# EAGLE design Drone Basic (EAGLE 9.6.2)
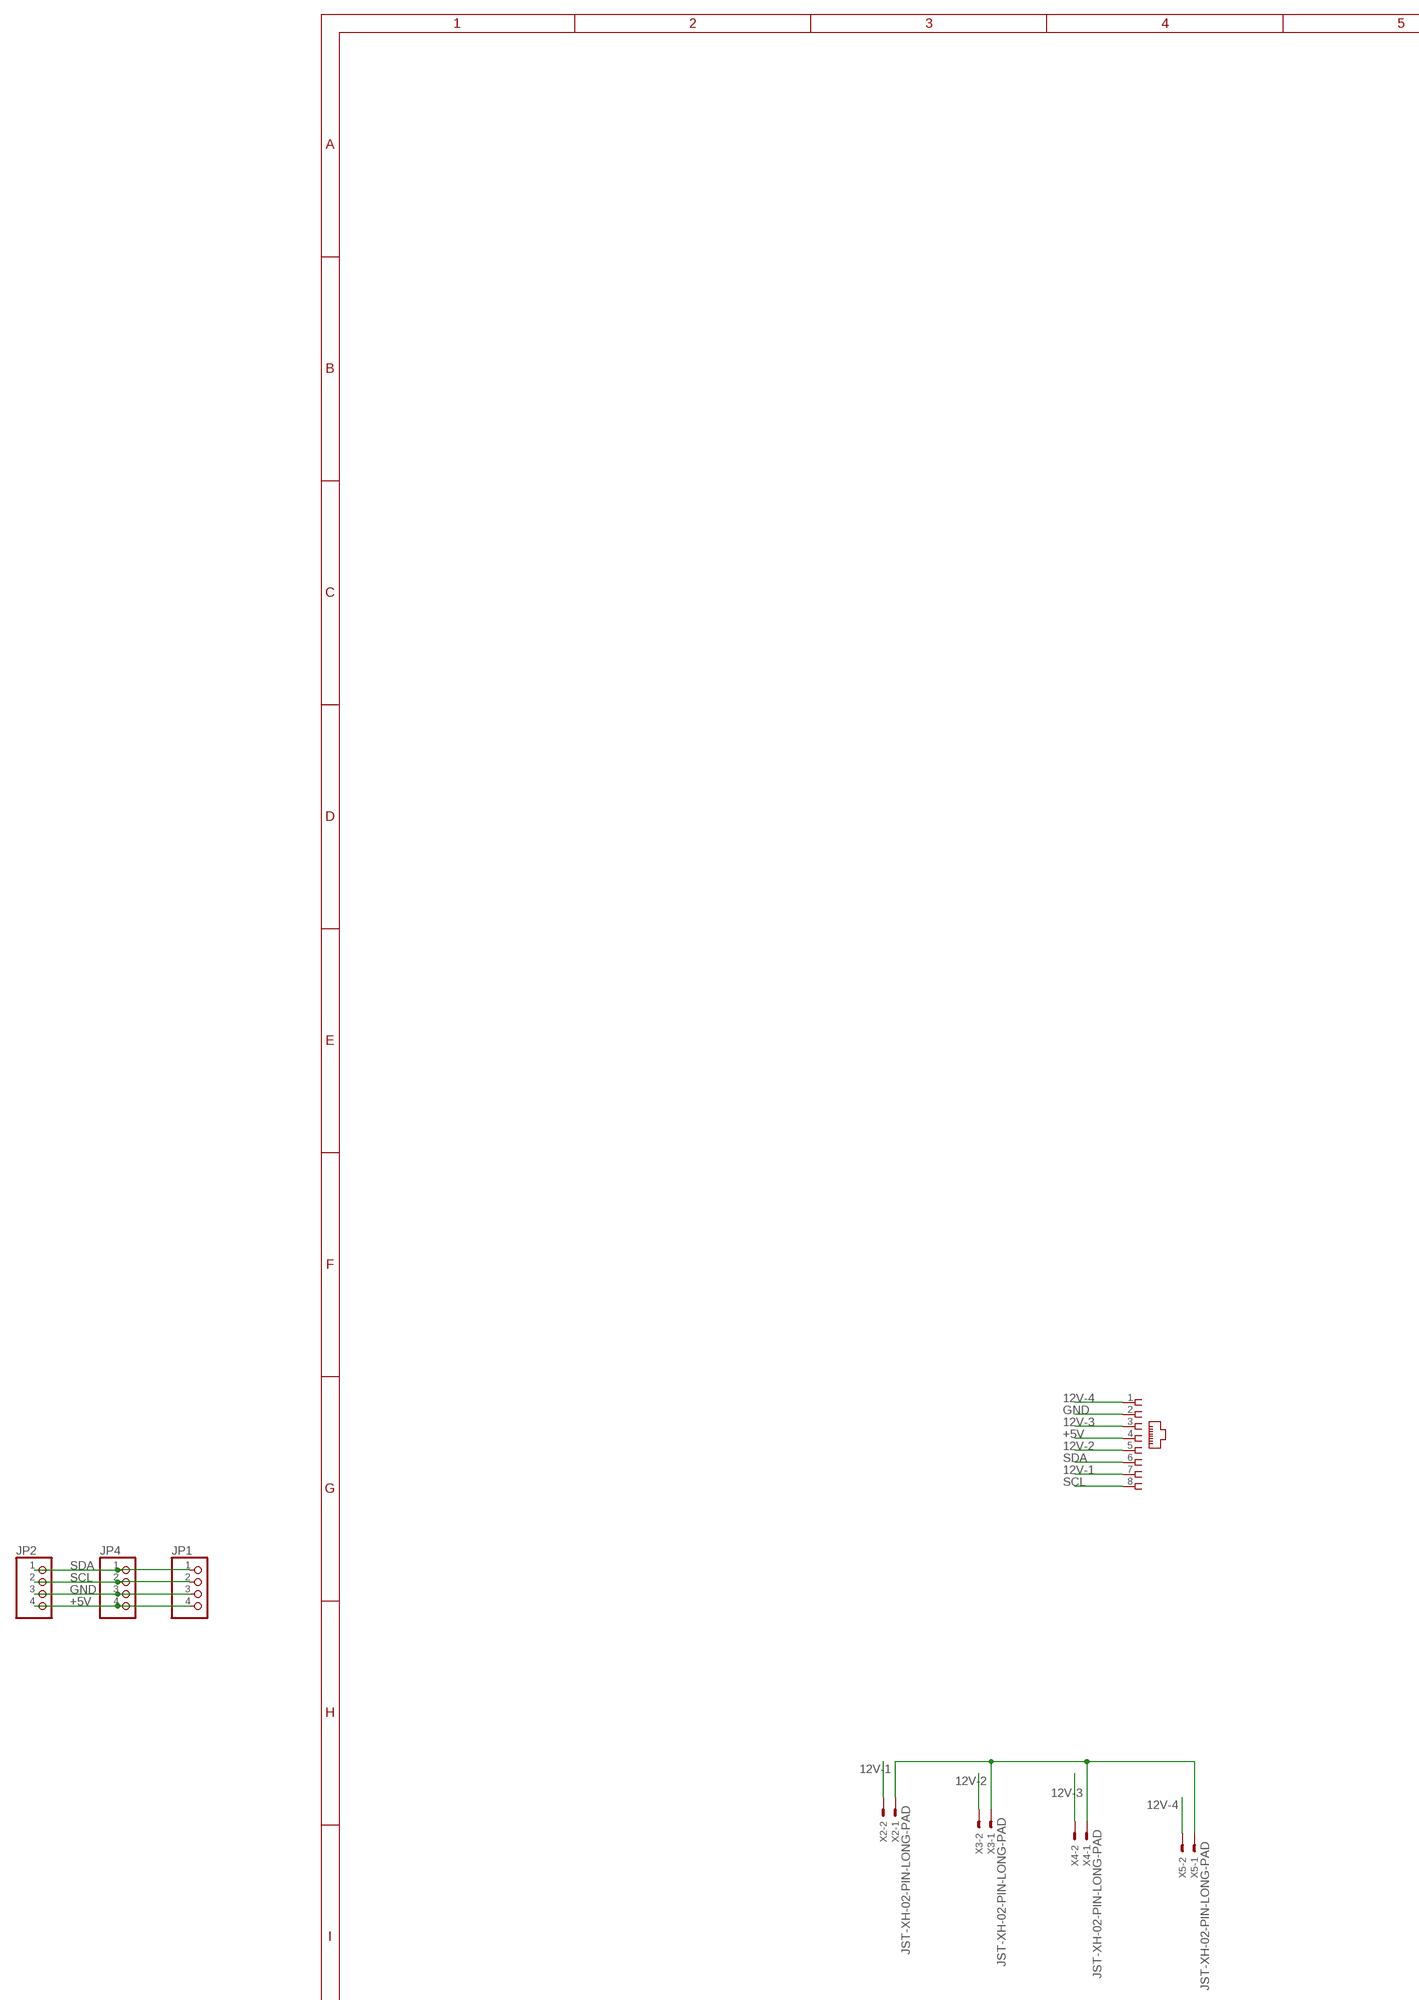
[diagram p0: schematic, sheet 1, part 1 of 2]
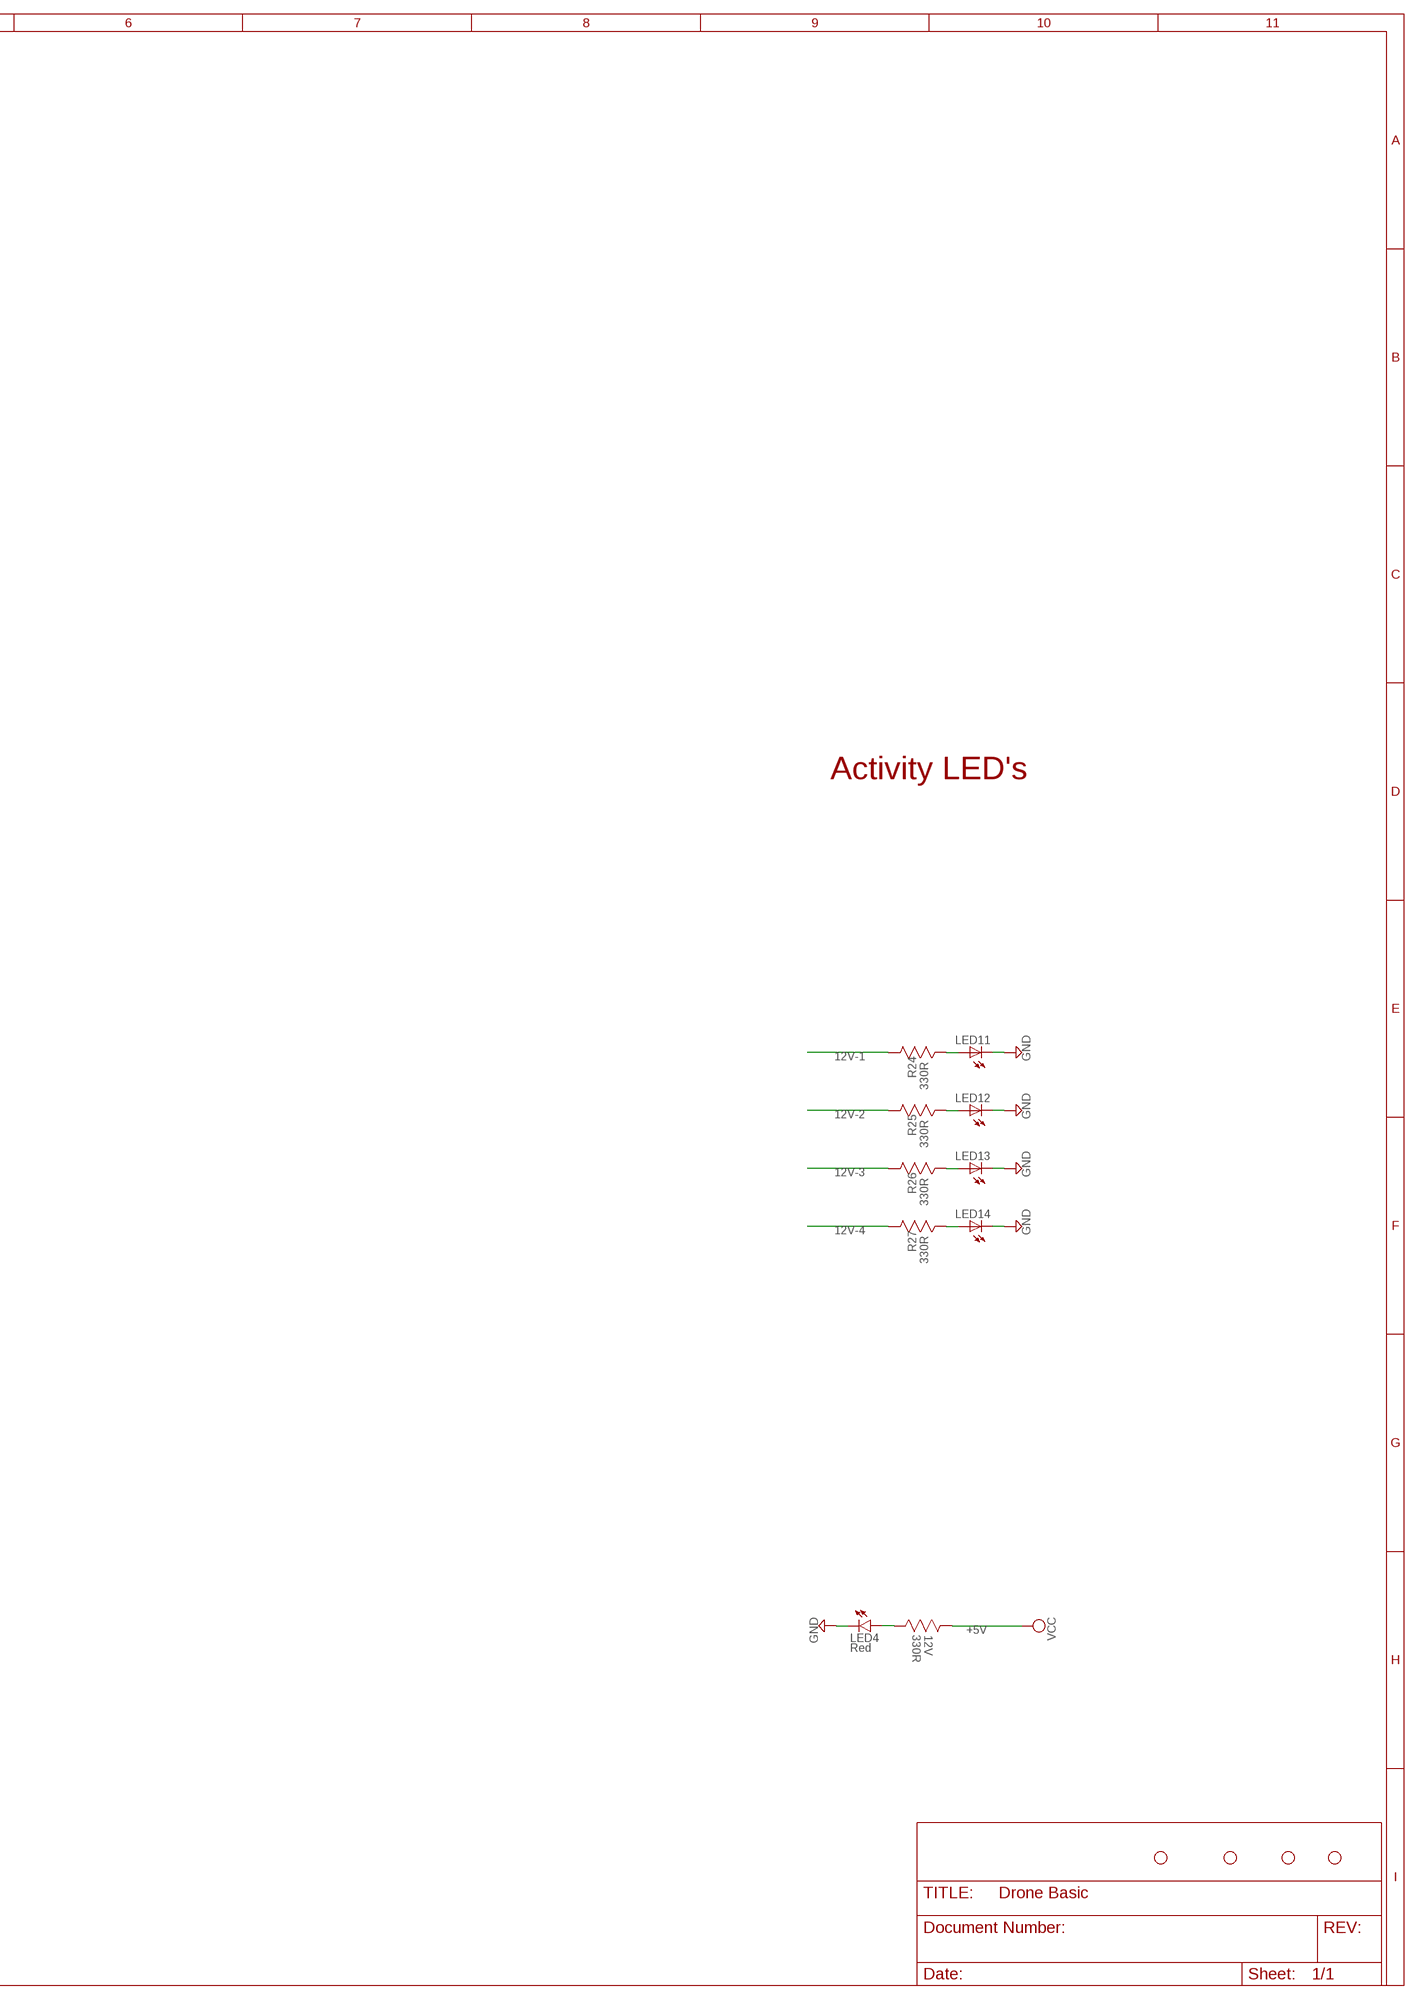
[diagram p1: schematic, sheet 1, part 2 of 2]

## Parts
12V  330R  MC0.063W06031%330R  [RESC1608X60N]
H5  STAND-OFF  [STAND-OFF]
H6  STAND-OFF  [STAND-OFF]
H7  STAND-OFF  [STAND-OFF]
H8  STAND-OFF  [STAND-OFF]
JP1  PINHD-1X4  [1X04]
JP2  PINHD-1X4  [1X04]
JP4  PINHD-1X4  [1X04]
LED4  Red  LED-RED-0603-WE  [LED-0603]
LED11  BLUE  LEDCHIPLED_0805  [CHIPLED_0805]
LED12  GREEN  LEDCHIPLED_0805  [CHIPLED_0805]
LED13  Yellow  LEDCHIPLED_0805  [CHIPLED_0805]
LED14  RED  LEDCHIPLED_0805  [CHIPLED_0805]
PUMPBOX-2  RJ45-6L-B  [RJ45-NO-SHIELD]
R24  330R  MC0.063W06031%330R  [RESC1608X60N]
R25  330R  MC0.063W06031%330R  [RESC1608X60N]
R26  330R  MC0.063W06031%330R  [RESC1608X60N]
R27  330R  MC0.063W06031%330R  [RESC1608X60N]
X2  JST-XH-02-PIN-LONG-PAD  [JST-XH-02-PACKAGE-LONG-PAD]
X3  JST-XH-02-PIN-LONG-PAD  [JST-XH-02-PACKAGE-LONG-PAD]
X4  JST-XH-02-PIN-LONG-PAD  [JST-XH-02-PACKAGE-LONG-PAD]
X5  JST-XH-02-PIN-LONG-PAD  [JST-XH-02-PACKAGE-LONG-PAD]

## Nets
12V-1: PUMPBOX-2.7 R24.1(R1) X2.2
12V-2: PUMPBOX-2.5 R25.1(R1) X3.2
12V-3: PUMPBOX-2.3 R26.1(R1) X4.2
12V-4: PUMPBOX-2.1 R27.1(R1) X5.2
+5V [5v]: 12V.1(R1) JP1.4 JP2.4 JP4.4 PUMPBOX-2.4 ; supply symbol labelled VCC
GND: JP1.3 JP2.3 JP4.3 LED4.C LED11.C LED12.C LED13.C LED14.C PUMPBOX-2.2 X2.1 X3.1 X4.1 X5.1
N$47: 12V.2(R2) LED4.A
N$54 [GPIO]: LED11.A R24.2(R2)
N$55 [GPIO]: LED12.A R25.2(R2)
N$56 [GPIO]: LED13.A R26.2(R2)
N$57 [GPIO]: LED14.A R27.2(R2)
SCL: JP1.2 JP2.2 JP4.2 PUMPBOX-2.8
SDA: JP1.1 JP2.1 JP4.1 PUMPBOX-2.6

## Notes on the sheet
- Activity LED's

## Library data of the parts
12V R24-R27 = Multicomp:MC0.063W06031%330R: RESISTOR, 0603; MPN: MC0.063W06031%330R; OC_FARNELL: 9331018; OC_NEWARK: -; SUPPLIER: Multicomp; TOLERANCE: ±1%; VALUE: 330 Ohms; WATTAGE: 1/16 W
H5-H8 = SparkFun-Hardware:STAND-OFF: Stand Off Drill holes for mechanically mounting via screws, standoffs, etc. Note: Use the keepout ring to avoid running the screw head into surrounding components. Variant Overviews STAND-OFF - Mechanical footprint for a #4 phillips button head screw. STAND-OFF-TIGHT - Mechanical footprint for a #4 phillips button head screw, Example SparkFun Products Screw - Phillips Head (1/4", 4-40, 10 pack) <https://www.sparkfun.com/products/10453> (PRT-10453) Screw - Phillips Head (1/2", 4-40, 10 pack) <https://www.sparkfun.com/products/10452> (PRT-10452) Screw - Phillips Head (3/4", 4-40, 10 pack) <https://www.sparkfun.com/products/10451> (PRT-10451) Screw - Phillips Head (1", 4-40, 10 pack) <https://www.sparkfun.com/products/10450> (PRT-10450)
JP1 JP2 JP4 = pinhead:PINHD-1X4: PIN HEADER
LED4 = SparkFun-LED:LED-RED: Red SMD LED Used in manufacturing of most products at SparkFun Packages: 0603 - SMD 0603 package [Product Link] <http://docs.avagotech.com/docs/AV02-0551EN> 0603 SMART - SMD 0603 SMART package ( more efficient and expensive)[Product Link] <http://www.osram-os.com/Graphics/XPic2/00077099_0.pdf> 1206 - SMD1206 package [Product Link] <https://www.sparkfun.com/datasheets/DevTools/LilyPad/Q150OVS4.pdff> SparkFun Products: Pro Mini 328 -5V <https://www.sparkfun.com/products/821> RedBoard <https://www.sparkfun.com/products/12757> IOIO-OTG <https://www.sparkfun.com/products/13613>; PROD_ID: DIO-16511
LED11-LED14 = adafruit:LED: LED OSRAM: - CHIPLED LG R971, LG N971, LY N971, LG Q971, LY Q971, LO R971, LY R971 LH N974, LH R974 LS Q976, LO Q976, LY Q976 LO Q996 - Hyper CHIPLED LW Q18S LB Q993, LB Q99A, LB R99A - SideLED LS A670, LO A670, LY A670, LG A670, LP A670 LB A673, LV A673, LT A673, LW A673 LH A674 LY A675 LS A676, LA A676, LO A676, LY A676, LW A676 LS A679, LY A679, LG A679 - Hyper Micro SIDELED® LS Y876, LA Y876, LO Y876, LY Y876 LT Y87S - SmartLED LW L88C, LW L88S LB L89C, LB L89S, LG L890 LS L89K, LO L89K, LY L89K LS L896, LA L896, LO L896, LY L896 - TOPLED LS T670, LO T670, LY T670, LG T670, LP T670 LSG T670, LSP T670, LSY T670, LOP T670, LYG T670 LG T671, LOG T671, LSG T671 LB T673, LV T673, LT T673, LW T673 LH T674 LS T676, LA T676, LO T676, LY T676, LB T676, LH T676, LSB T676, LW T676 LB T67C, LV T67C, LT T67C, LS T67K, LO T67K, LY T67K, LW E67C LS E67B, LA E67B, LO E67B, LY E67B, LB E67C, LV E67C, LT E67C LW T67C LS T679, LY T679, LG T679 LS T770, LO T770, LY T770, LG T770, LP T770 LB T773, LV T773, LT T773, LW T773 LH T774 LS E675, LA E675, LY E675, LS T675 LS T776, LA T776, LO T776, LY T776, LB T776 LHGB T686 LT T68C, LB T68C - Hyper Mini TOPLED® LB M676 - Mini TOPLED Santana® LG M470 LS M47K, LO M47K, LY M47K Source: http://www.osram.convergy.de/
PUMPBOX-2 = con-tycoelectronics:RJ45: CORCOM Modular RJ Jacks No Shield Source: www.tycoelectronics.com .. ENG_DS_1654001_1099_RJ_L_0507.pdf; MPN: RJ45-6L-B; OC_FARNELL: unknown; OC_NEWARK: 16R6090
X2-X5 = Rembrandt Electronics - JST XH Connectors v1-0:JST-XH-02-PIN: JST XH Connector 2 Pin Wire to board connector. Pitch: 2,54 mm, (0.100") Number of pins: 2 Created by Rembrandt Electronics www.rembrandtelectronics.com

## Net classes
0 default: width 0.356 mm, drill 0.102 mm, clearance 0.254 mm
1 highpower: width 0.356 mm, drill 0.356 mm
2 12v: width 0.457 mm, drill 0.102 mm, clearance 0.254 mm
3 5v: width 0.406 mm, drill 0.102 mm, clearance 0.254 mm
4 3.3v: width 0.406 mm, drill 0.102 mm, clearance 0.254 mm
5 i2c: width 0.356 mm, drill 0.102 mm, clearance 0.254 mm
6 GPIO: width 0.356 mm, drill 0.102 mm, clearance 0.254 mm
8 New Class: drill 0.102 mm, clearance 0.152 mm

## Board
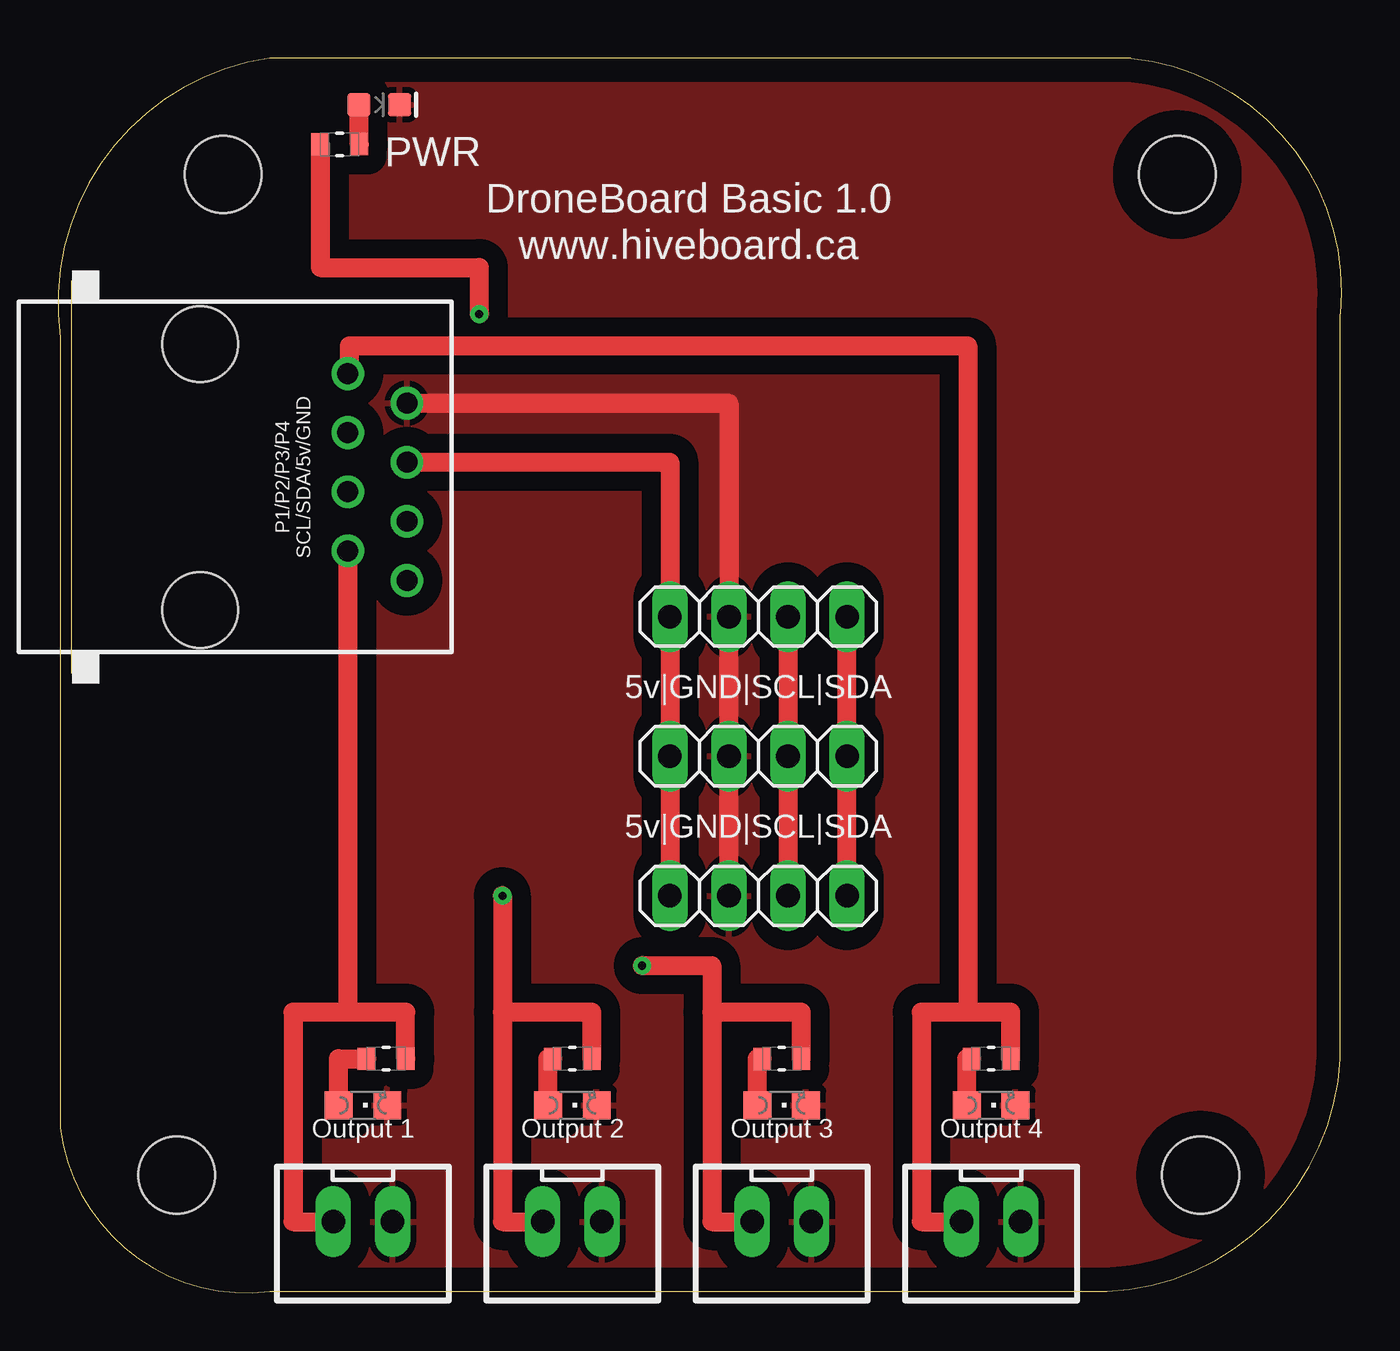
[diagram p2: board, top side]
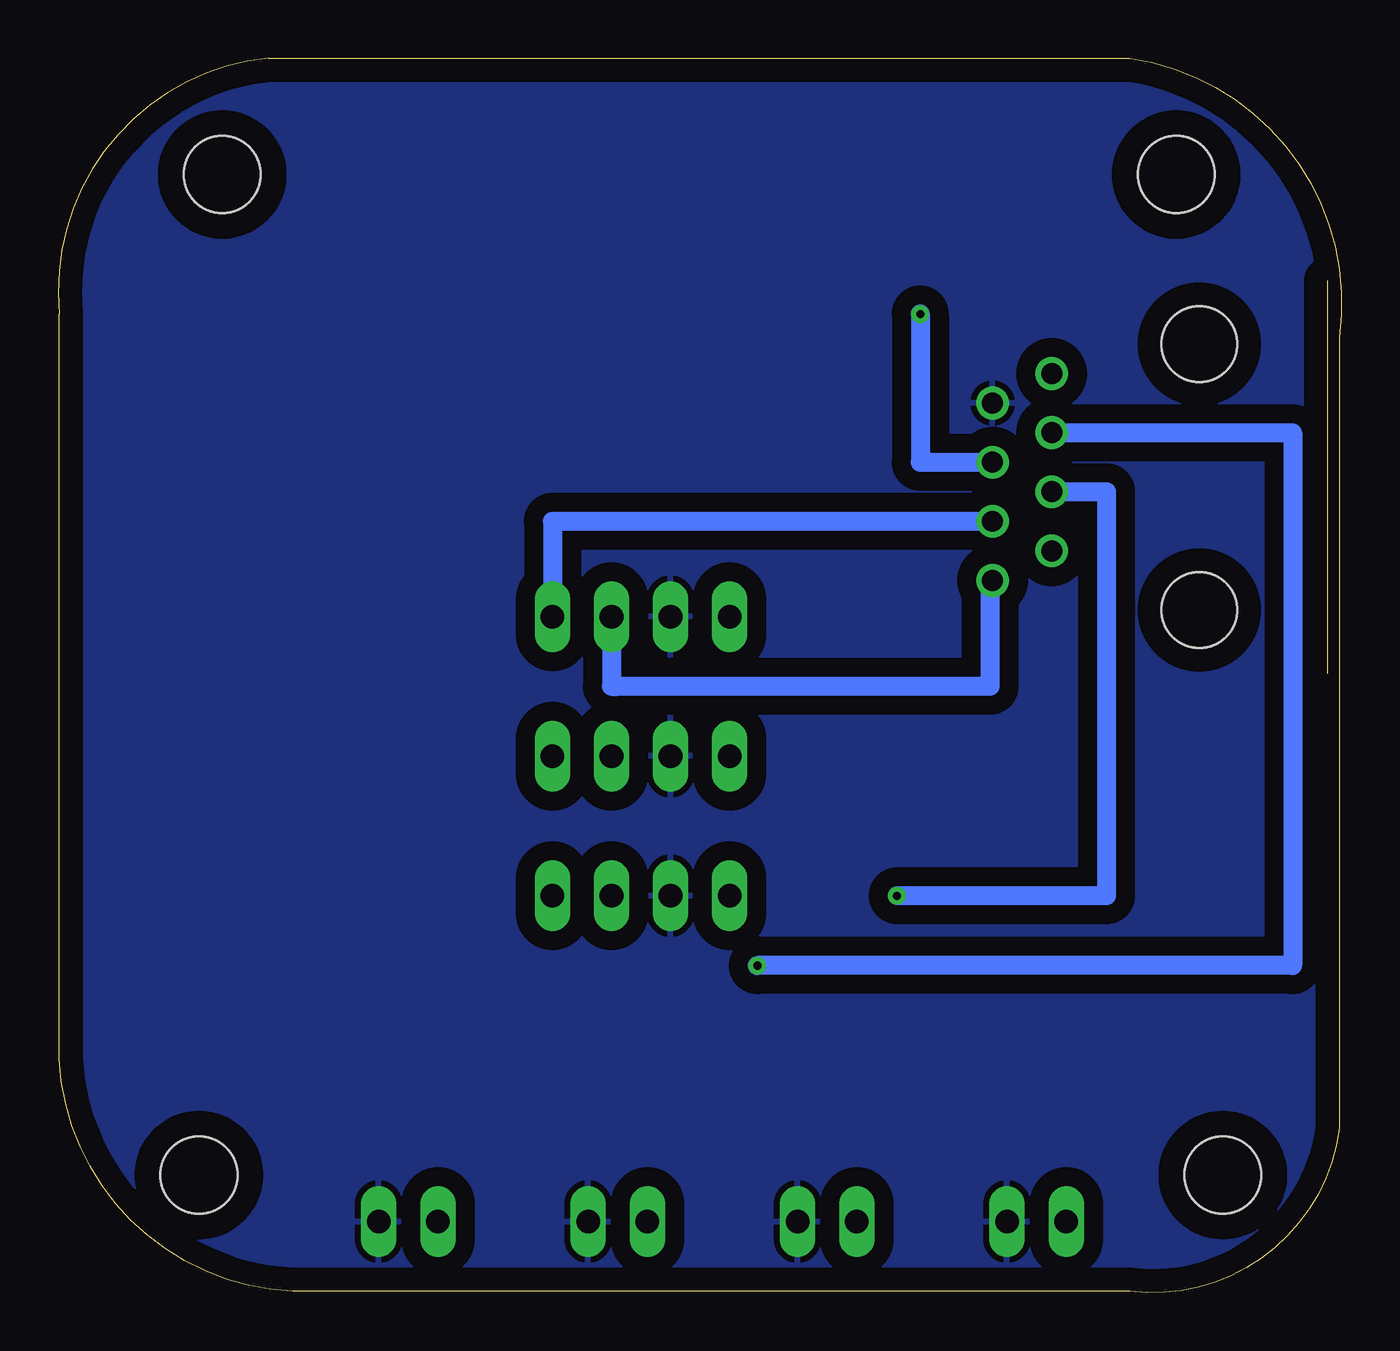
[diagram p3: board, bottom side, seen from below]

Size 55.15 x 53.06 mm. Coordinates in mm from the lower left corner, seen from the top.
Outline: 9.1,0.06 44.1,0.06 arc90 55.1,10.06 55.1,42.06 arc90 46.1,53.06 9.1,53.06 arc90 0.1,41.06 0.1,7.06 arc90 9.1,0.06
Copper layers (1*16): Top 0.035mm / dielectric 1.5mm / Bottom 0.035mm
Design rules "default *": minimum track width 6mil, minimum drill 0.35mm, track to track 6mil, track to pad 6mil, pad to pad 6mil, via to via 6mil, smd to smd 6mil, copper to edge 40mil, drill to drill 6mil, minimum pad ring 10mil, minimum via ring 8mil, stop-mask expansion 4mil, vias tented up to drill 0mil, thermal gap 10mil

### Footprints (pad centres in the part's own frame; a part is rotated, then mirrored left to right if it is on the bottom)
RESC1608X60N = smd 0.762 x 0.94: 1 -0.838,0; 2 0.838,0
STAND-OFF = hole 3.302: 0,0
1X04 = drill 1.016 long: 1 -3.81,0; 2 -1.27,0; 3 1.27,0; 4 3.81,0
LED-0603 = smd 1 x 1: A -0.877,0; C 0.877,0
CHIPLED_0805 = smd 1.2 x 1.2: A 0,-1.05; C 0,1.05
RJ45-NO-SHIELD = drill 0.9 pad 1.4: 1 -4.445,6.35; 2 -3.175,8.89; 3 -1.905,6.35; 4 -0.635,8.89; 5 0.635,6.35; 6 1.905,8.89; 7 3.175,6.35; 8 4.445,8.89 | hole 3.251: -5.715,0; 5.715,0
JST-XH-02-PACKAGE-LONG-PAD = drill 1.016 long: 1 -1.27,0; 2 1.27,0

### Placement (x,y rotation side)
12V  12.1,49.36 0 top
H5  7.1,48.06 0 top
H6  5.1,5.06 0 top
H7  49.1,5.06 0 top
H8  48.1,48.06 0 top
JP1  30.1,17.06 180 top
JP2  30.1,29.06 180 top
JP4  30.1,23.06 180 top
LED4  13.8,51.06 0 top
LED11  13.1,8.06 270 top
LED12  22.1,8.06 270 top
LED13  31.1,8.06 270 top
LED14  40.1,8.06 270 top
PUMPBOX-2  6.1,35.06 270 top
R24  14.1,10.06 180 top
R25  22.1,10.06 180 top
R26  31.1,10.06 180 top
R27  40.1,10.06 180 top
X2  13.1,3.06 180 top
X3  22.1,3.06 180 top
X4  31.1,3.06 180 top
X5  40.1,3.06 180 top

### Tracks (layer width: path | path; a pad name or v marks a point on that pad's centre or on a via)
12V-1
  Top 0.813: R24.1 14.93,12.06 12.45,12.06 | X2.2 10.1,3.06 10.1,12.06 12.1,12.06 12.45,12.06 | PUMPBOX-2.7 12.45,12.06
12V-2  (via drill 0.35)
  Top 0.813: R25.1 22.93,12.06 19.1,12.06 | 19.1,12.06 19.1,3.06 X3.2 | v19.1,17.06 19.1,12.06
  Bottom 0.813: PUMPBOX-2.5 10.1,34.42 10.1,17.06 v19.1,17.06
12V-3  (via drill 0.35)
  Top 0.813: R26.1 31.93,12.06 28.1,12.06 | 28.1,12.06 28.1,3.06 X4.2 | v25.1,14.06 28.1,14.06 28.1,12.06
  Bottom 0.813: PUMPBOX-2.3 2.1,36.96 2.1,14.06 v25.1,14.06
12V-4
  Top 0.813: R27.1 40.93,12.06 39.1,12.06 | 39.1,12.06 37.1,12.06 37.1,3.06 X5.2 | PUMPBOX-2.1 12.52,39.5 12.52,40.7 39.1,40.7 39.1,12.06
+5V  (via drill 0.35)
  Top 0.813: JP1.4 JP4.4 JP2.4 26.29,35.69 PUMPBOX-2.4 | 12V.1 11.26,44.06 18.1,44.06 v18.1,42.06
  Bottom 0.813: v18.1,42.06 18.1,35.69 PUMPBOX-2.4
GND
  Top 0.813: JP1.3 JP4.3 JP2.3 28.83,38.23 PUMPBOX-2.2
  pour Bottom (isolate 0.813): 0.1,0.06 55.1,0.06 55.1,25.06 55.1,53.06 28.1,53.06 0.1,53.06
  pour Top (isolate 0.813): 0.1,0.06 50.1,0.06 55.1,0.06 55.1,25.06 55.1,53.06 21.1,53.06 0.1,53.06
N$47
  Top 0.813: 12V.2 12.93,51.06 LED4.A
N$54
  Top 0.813: LED11.A 12.05,10.06 R24.2
N$55
  Top 0.813: LED12.A 21.05,10.06 R25.2
N$56
  Top 0.813: LED13.A 30.05,10.06 R26.2
N$57
  Top 0.813: LED14.A 39.05,10.06 R27.2
SCL
  Top 0.813: JP2.2 JP4.2 JP1.2
  Bottom 0.813: PUMPBOX-2.8 15.1,30.61 15.1,26.06 31.1,26.06 31.37,26.06 JP2.2
SDA
  Top 0.813: JP1.1 JP4.1 JP2.1
  Bottom 0.813: PUMPBOX-2.6 33.91,33.15 JP2.1

### Text on the board
tPlace: PWR | DroneBoard Basic 1.0 | www.hiveboard.ca | P1/P2/P3/P4 / SCL/SDA/5v/GND | 5v|GND|SCL|SDA | 5v|GND|SCL|SDA | Output 1 | Output 2 | Output 3 | Output 4